# EAGLE design 85-2031red (EAGLE 6.6.0)
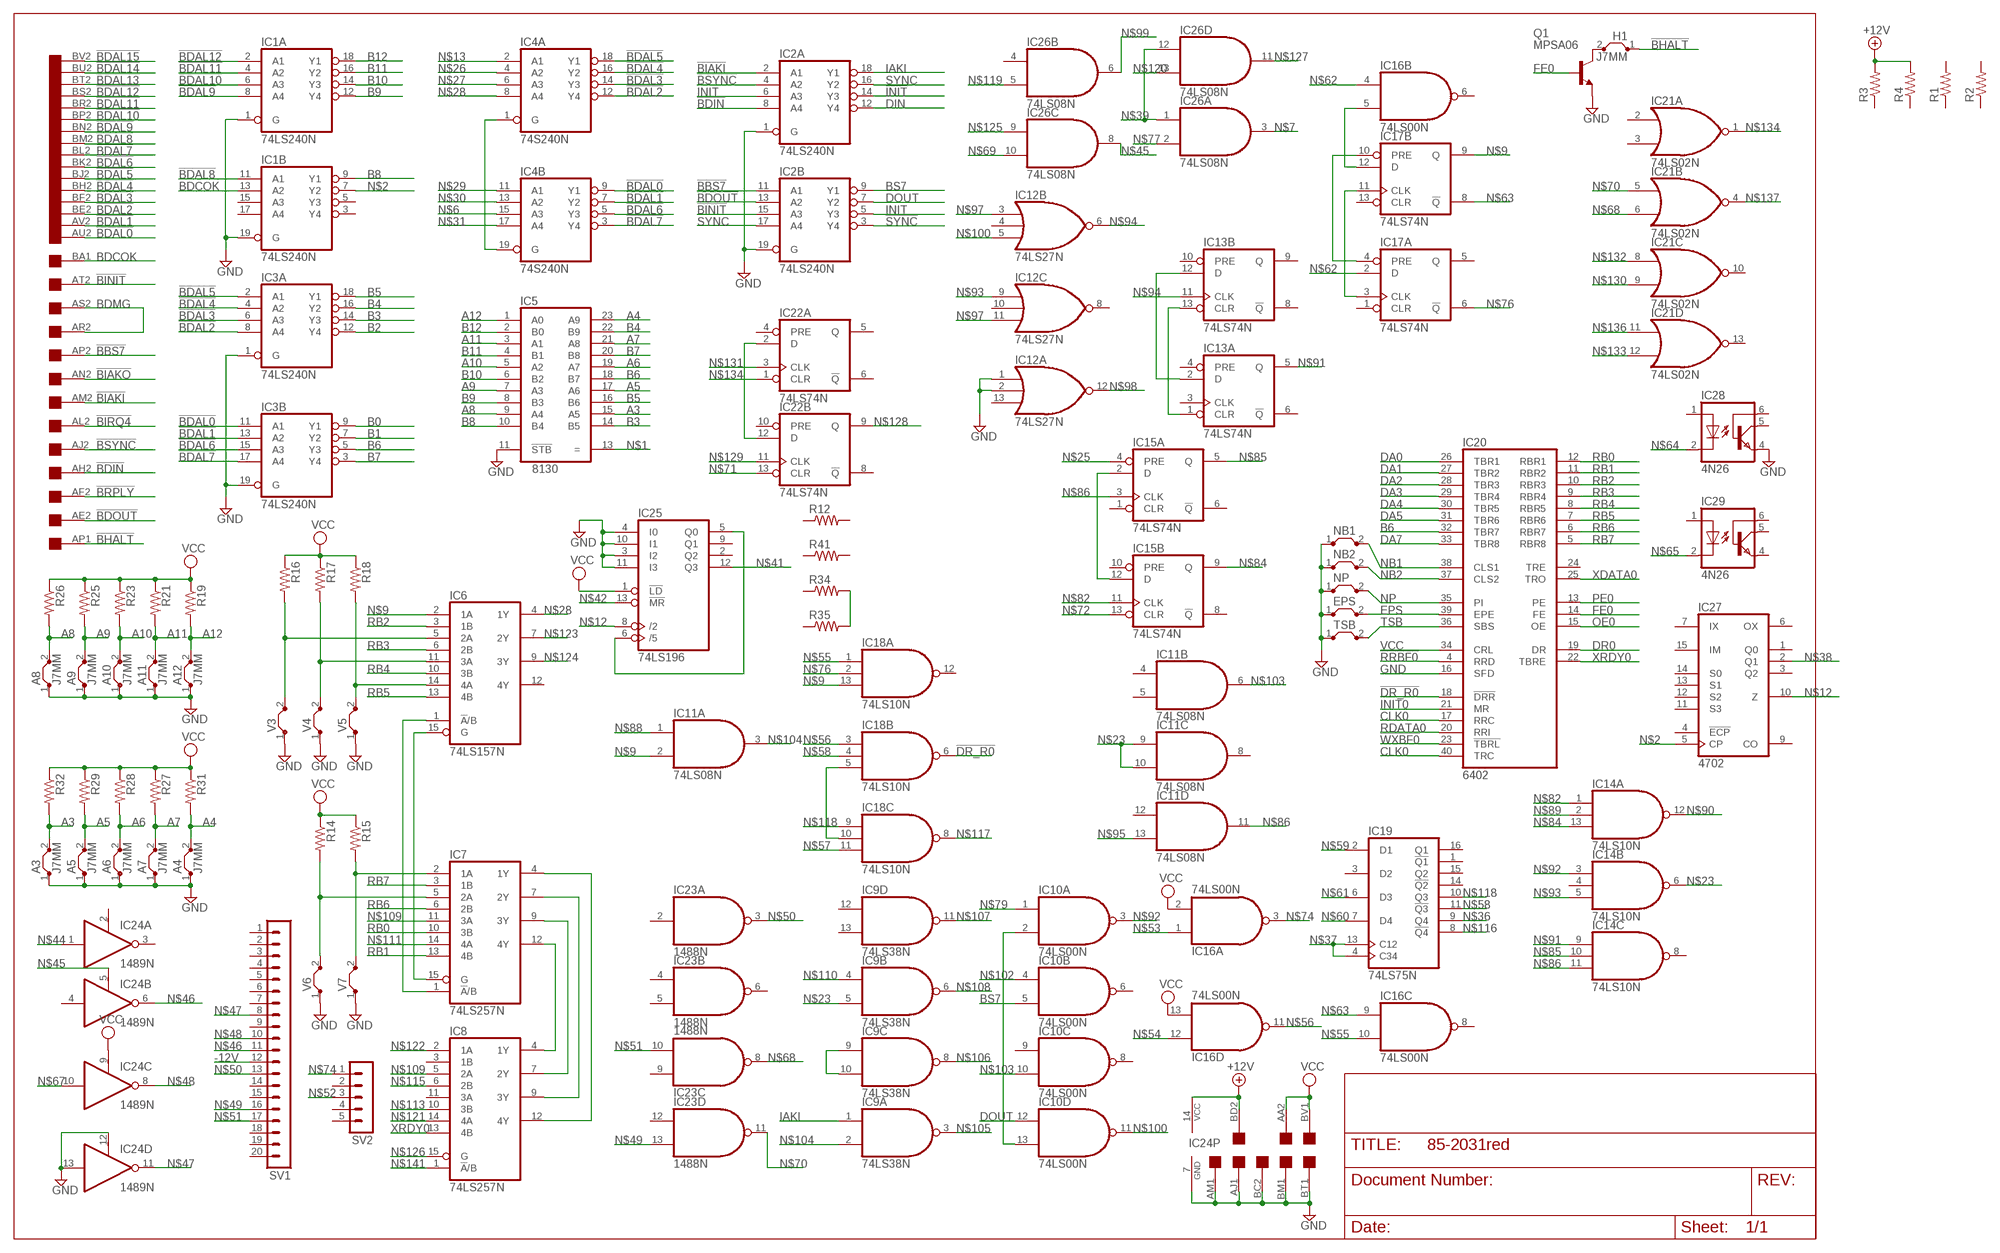
[diagram p0: schematic, sheet 1]

## Parts
A3  J7MM  [07]
A4  J7MM  [07]
A5  J7MM  [07]
A6  J7MM  [07]
A7  J7MM  [07]
A8  J7MM  [07]
A9  J7MM  [07]
A10  J7MM  [07]
A11  J7MM  [07]
A12  J7MM  [07]
EDGE$  DOUBLE  [EDGE-CON4]
EPS  J7MM  [07]
H1  J7MM  [07]
IC1  74LS240N  [DIL20]
IC2  74LS240N  [DIL20]
IC3  74LS240N  [DIL20]
IC4  74S240N  [DIL20]
IC5  8130  [DIL24]
IC6  74LS157N  [DIL16]
IC7  74LS257N  [DIL16]
IC8  74LS257N  [DIL16]
IC9  74LS38N  [DIL14]
IC10  74LS00N  [DIL14]
IC11  74LS08N  [DIL14]
IC12  74LS27N  [DIL14]
IC13  74LS74N  [DIL14]
IC14  74LS10N  [DIL14]
IC15  74LS74N  [DIL14]
IC16  74LS00N  [DIL14]
IC17  74LS74N  [DIL14]
IC18  74LS10N  [DIL14]
IC19  74LS75N  [DIL16]
IC20  6402  HD6402  [DIL40]
IC21  74LS02N  [DIL14]
IC22  74LS74N  [DIL14]
IC23  1488N  [DIL14]
IC24  1489N  [DIL14]
IC25  74LS196  [DIL14]
IC26  74LS08N  [DIL14]
IC27  4702  HD4702  [DIL16]
IC28  4N26  4N35  [DIL06]
IC29  4N26  4N35  [DIL06]
NB1  J7MM  [07]
NB2  J7MM  [07]
NP  J7MM  [07]
Q1  MPSA06  -NPN-TO92L  [TO92L]
R1  R-US_0207/10  [0207/10]
R2  R-US_0207/10  [0207/10]
R3  R-US_0207/10  [0207/10]
R4  R-US_0207/10  [0207/10]
R12  R-US_0207/10  [0207/10]
R14  R-US_0207/10  [0207/10]
R15  R-US_0207/10  [0207/10]
R16  R-US_0207/10  [0207/10]
R17  R-US_0207/10  [0207/10]
R18  R-US_0207/10  [0207/10]
R19  R-US_0207/10  [0207/10]
R21  R-US_0207/10  [0207/10]
R23  R-US_0207/10  [0207/10]
R25  R-US_0207/10  [0207/10]
R26  R-US_0207/10  [0207/10]
R27  R-US_0207/10  [0207/10]
R28  R-US_0207/10  [0207/10]
R29  R-US_0207/10  [0207/10]
R31  R-US_0207/10  [0207/10]
R32  R-US_0207/10  [0207/10]
R34  R-US_0207/10  [0207/10]
R35  R-US_0207/10  [0207/10]
R41  R-US_0207/10  [0207/10]
SV1  MA20-1  [MA20-1]
SV2  MA05-1  [MA05-1]
TSB  J7MM  [07]
V3  J7MM  [07]
V4  J7MM  [07]
V5  J7MM  [07]
V6  J7MM  [07]
V7  J7MM  [07]

## Nets
!BBS7: EDGE$.AP2 IC2.11(B:A1)
!BDAL0: EDGE$.AU2 IC3.11(B:A1) IC4.9(B:Y1)
!BDAL1: EDGE$.AV2 IC3.13(B:A2) IC4.7(B:Y2)
!BDAL2: EDGE$.BE2 IC3.8(A:A4) IC4.12(A:Y4)
!BDAL3: EDGE$.BF2 IC3.6(A:A3) IC4.14(A:Y3)
!BDAL4: EDGE$.BH2 IC3.4(A:A2) IC4.16(A:Y2)
!BDAL5: EDGE$.BJ2 IC3.2(A:A1) IC4.18(A:Y1)
!BDAL6: EDGE$.BK2 IC3.15(B:A3) IC4.5(B:Y3)
!BDAL7: EDGE$.BL2 IC3.17(B:A4) IC4.3(B:Y4)
!BDAL8: EDGE$.BM2 IC1.11(B:A1)
!BDAL9: EDGE$.BN2 IC1.8(A:A4)
!BDAL10: EDGE$.BP2 IC1.6(A:A3)
!BDAL11: EDGE$.BR2 IC1.4(A:A2)
!BDAL12: EDGE$.BS2 IC1.2(A:A1)
!BDAL13: EDGE$.BT2
!BDAL14: EDGE$.BU2
!BDAL15: EDGE$.BV2
!BDIN: EDGE$.AH2 IC2.8(A:A4)
!BDOUT: EDGE$.AE2 IC2.13(B:A2)
!BHALT: EDGE$.AP1 H1.1
!BIAKI: EDGE$.AM2 IC2.2(A:A1)
!BIAKO: EDGE$.AN2
!BINIT: EDGE$.AT2 IC2.15(B:A3)
!BIRQ4: EDGE$.AL2
!BRPLY: EDGE$.AF2
!BSYNC: EDGE$.AJ2 IC2.4(A:A2)
!DR_R0: IC18.6(B:O) IC20.18(!DRR)
!INIT: IC2.14(A:Y3)
!RRBF0: IC20.4(RRD)
!SYNC: IC2.3(B:Y4)
!WXBF0: IC20.23(!TBRL)
+12V [Supply]: EDGE$.BD2 IC24.14(P:VCC) R3.2 R4.2
-12V: SV1.12
A3: A3.2 IC5.15(A5) R32.2
A4: A4.2 IC5.23(A9) R31.2
A5: A5.2 IC5.17(A6) R29.2
A6: A6.2 IC5.19(A7) R28.2
A7: A7.2 IC5.21(A8) R27.2
A8: A8.2 IC5.9(A4) R26.2
A9: A9.2 IC5.7(A3) R25.2
A10: A10.2 IC5.5(A2) R23.2
A11: A11.2 IC5.3(A1) R21.2
A12: A12.2 IC5.1(A0) R19.2
B0: IC3.9(B:Y1) IC22.2(A:D) IC22.12(B:D)
B1: IC3.7(B:Y2)
B2: IC3.12(A:Y4)
B3: IC3.14(A:Y3) IC5.14(B5)
B4: IC3.16(A:Y2) IC5.22(B9)
B5: IC3.18(A:Y1) IC5.16(B6)
B6: IC3.5(B:Y3) IC5.18(B7) IC20.32(TBR7)
B7: IC3.3(B:Y4) IC5.20(B8)
B8: IC1.9(B:Y1) IC5.10(B4)
B9: IC1.12(A:Y4) IC5.8(B3)
B10: IC1.14(A:Y3) IC5.6(B2)
B11: IC1.16(A:Y2) IC5.4(B1)
B12: IC1.18(A:Y1) IC5.2(B0)
BDCOK: EDGE$.BA1 IC1.13(B:A2)
BDMG: EDGE$.AR2 EDGE$.AS2
BS7: IC2.9(B:Y1) IC10.5(B:I1)
CLK0: IC20.17(RRC) IC20.40(TRC)
DA0: IC20.26(TBR1)
DA1: IC20.27(TBR2)
DA2: IC20.28(TBR3)
DA3: IC20.29(TBR4)
DA4: IC20.30(TBR5)
DA5: IC20.31(TBR6)
DA7: IC20.33(TBR8)
DIN: IC2.12(A:Y4)
DOUT: IC2.7(B:Y2) IC10.12(D:I0)
DR0: IC20.19(DR)
EPS: EPS.2 IC20.39(EPE)
FE0: IC20.14(FE) Q1.2(B)
GND [Supply]: A3.1 A4.1 A5.1 A6.1 A7.1 A8.1 A9.1 A10.1 A11.1 A12.1 EDGE$.AJ1 EDGE$.AM1 EDGE$.BC2 EDGE$.BM1 EDGE$.BT1 EPS.1 IC1.1(A:G) IC1.19(B:G) IC2.1(A:G) IC2.19(B:G) IC3.1(A:G) IC3.19(B:G) IC5.11(!STB) IC12.1(A:I0) IC12.2(A:I1) IC20.16(SFD) IC24.7(P:GND) IC24.12(D:RC) IC24.13(D:I) IC25.3(I2) IC25.4(I0) IC25.10(I1) IC25.11(I3) IC28.4(EMI) NB1.1 NB2.1 NP.1 Q1.1(E) TSB.1 V3.1 V4.1 V5.1 V6.1 V7.1
IAKI: IC2.18(A:Y1) IC9.1(A:I0)
INIT: IC2.5(B:Y3) IC2.6(A:A3)
INIT0: IC20.21(MR)
N$1: IC5.13(=)
N$2: IC1.7(B:Y2) IC27.5(CP)
N$3: H1.2 Q1.3(C)
N$4: IC6.15(G) IC7.15(G)
N$5: IC6.1(!A!/B) IC7.1(!A!/B)
N$6: IC4.15(B:A3)
N$7: IC4.1(A:G) IC4.19(B:G) IC26.3(A:O)
N$8: IC6.14(4A) R18.2 V5.2
N$9: IC6.2(1A) IC11.2(A:I1) IC17.9(B:Q) IC18.13(A:I2)
N$10: IC7.12(4Y) IC8.4(1Y)
N$11: IC7.9(3Y) IC8.7(2Y)
N$12: IC25.8(/2) IC27.10(Z)
N$13: IC4.2(A:A1)
N$14: IC7.7(2Y) IC8.9(3Y)
N$15: IC7.4(1Y) IC8.12(4Y)
N$17: IC7.2(1A) R15.2 V7.2
N$18: IC7.5(2A) R14.2 V6.2
N$19: IC9.9(C:I0) IC9.10(C:I1)
N$20: R34.2 R35.2
N$21: IC6.11(3A) R17.2 V4.2
N$22: IC10.2(A:I1) IC10.13(D:I1)
N$23: IC9.5(B:I1) IC11.9(C:I0) IC11.10(C:I1) IC14.6(B:O)
N$24: IC6.5(2A) R16.2 V3.2
N$25: IC13.1(A:CLR) IC13.13(B:CLR) IC15.4(A:PRE)
N$26: IC4.4(A:A2)
N$27: IC4.6(A:A3)
N$28: IC4.8(A:A4) IC6.4(1Y)
N$29: IC4.11(B:A1)
N$30: IC4.13(B:A2)
N$31: IC4.17(B:A4)
N$32: IC13.2(A:D) IC13.12(B:D)
N$33: IC16.5(B:I1) IC17.12(B:D)
N$34: IC17.3(A:CLK) IC17.11(B:CLK)
N$35: IC17.4(A:PRE) IC17.10(B:PRE)
N$36: IC18.5(B:I2) IC18.10(C:I1) IC19.9(Q4)
N$37: IC19.4(C34) IC19.13(C12)
N$38: IC27.2(Q1)
N$39: IC26.1(A:I0) IC26.12(D:I0)
N$40: IC25.5(Q0) IC25.6(/5)
N$41: IC25.12(Q3)
N$42: IC25.13(!MR)
N$44: IC24.1(A:I)
N$45: IC24.5(B:RC) IC26.8(C:O)
N$46: IC24.6(B:O) SV1.11
N$47: IC24.11(D:O) SV1.8
N$48: IC24.8(C:O) SV1.10
N$49: IC23.13(D:I1) SV1.16
N$50: IC23.3(A:O) SV1.13
N$51: IC23.10(C:I1) SV1.17
N$52: SV2.3
N$53: IC16.1(A:I0)
N$54: IC16.12(D:I0)
N$55: IC16.10(C:I1) IC18.1(A:I0)
N$56: IC16.11(D:O) IC18.3(B:I0)
N$57: IC18.11(C:I2)
N$58: IC18.4(B:I1) IC19.11(!Q3)
N$59: IC19.2(D1)
N$60: IC19.7(D4)
N$61: IC19.6(D3)
N$62: IC16.4(B:I0) IC17.2(A:D)
N$63: IC16.9(C:I0) IC17.8(B:!Q)
N$64: IC28.2(C)
N$65: IC29.2(C)
N$67: IC24.10(C:I)
N$68: IC21.6(B:I1) IC23.8(C:O)
N$69: IC26.10(C:I1)
N$70: IC21.5(B:I0) IC23.11(D:O)
N$71: IC22.13(B:CLR)
N$72: IC15.13(B:CLR)
N$74: IC16.3(A:O) SV2.1
N$76: IC17.6(A:!Q) IC18.2(A:I1)
N$77: IC26.2(A:I1)
N$79: IC10.1(A:I0)
N$82: IC14.1(A:I0) IC15.11(B:CLK)
N$83: IC15.2(A:D) IC15.12(B:D)
N$84: IC14.13(A:I2) IC15.9(B:Q)
N$85: IC14.10(C:I1) IC15.5(A:Q)
N$86: IC11.11(D:O) IC14.11(C:I2) IC15.3(A:CLK)
N$88: IC11.1(A:I0)
N$89: IC14.2(A:I1)
N$90: IC14.12(A:O)
N$91: IC13.5(A:Q) IC14.9(C:I0)
N$92: IC10.3(A:O) IC14.3(B:I0)
N$93: IC12.9(C:I0) IC14.5(B:I2)
N$94: IC12.6(B:O) IC13.11(B:CLK)
N$95: IC11.13(D:I1)
N$97: IC12.3(B:I0) IC12.11(C:I2)
N$98: IC12.12(A:O)
N$99: IC26.6(B:O)
N$100: IC10.11(D:O) IC12.5(B:I2)
N$102: IC10.4(B:I0)
N$103: IC10.10(C:I1) IC11.6(B:O)
N$104: IC9.2(A:I1) IC11.3(A:O)
N$105: IC9.3(A:O)
N$106: IC9.8(C:O)
N$107: IC9.11(D:O)
N$108: IC9.6(B:O)
N$109: IC7.11(3A) IC8.5(2A)
N$110: IC9.4(B:I0)
N$111: IC7.14(4A)
N$113: IC8.10(3B)
N$115: IC8.6(2B)
N$116: IC19.8(!Q4)
N$117: IC18.8(C:O)
N$118: IC18.9(C:I0) IC19.10(Q3)
N$119: IC26.5(B:I1)
N$120: IC26.13(D:I1)
N$121: IC8.14(4A)
N$122: IC8.2(1A)
N$123: IC6.7(2Y)
N$124: IC6.9(3Y)
N$125: IC26.9(C:I0)
N$126: IC8.15(G)
N$127: IC26.11(D:O)
N$128: IC22.9(B:Q)
N$129: IC22.11(B:CLK)
N$130: IC21.9(C:I1)
N$131: IC22.3(A:CLK)
N$132: IC21.8(C:I0)
N$133: IC21.12(D:I1)
N$134: IC21.1(A:O) IC22.1(A:CLR)
N$136: IC21.11(D:I0)
N$137: IC21.4(B:O)
N$141: IC8.1(!A!/B)
NB1: IC20.38(CLS1) NB1.2
NB2: IC20.37(CLS2) NB2.2
NP: IC20.35(PI) NP.2
OE0: IC20.15(OE)
PE0: IC20.13(PE)
RB0: IC7.10(3B) IC20.12(RBR1)
RB1: IC7.13(4B) IC20.11(RBR2)
RB2: IC6.3(1B) IC20.10(RBR3)
RB3: IC6.6(2B) IC20.9(RBR4)
RB4: IC6.10(3B) IC20.8(RBR5)
RB5: IC6.13(4B) IC20.7(RBR6)
RB6: IC7.6(2B) IC20.6(RBR7)
RB7: IC7.3(1B) IC20.5(RBR8)
RDATA0: IC20.20(RRI)
SYNC: IC2.16(A:Y2) IC2.17(B:A4)
TSB: IC20.36(SBS) TSB.2
VCC: EDGE$.AA2 EDGE$.BV1 IC16.2(A:I1) IC16.13(D:I1) IC20.34(CRL) IC24.9(C:RC) IC25.1(!LD) R14.1 R15.1 R16.1 R17.1 R18.1 R19.1 R21.1 R23.1 R25.1 R26.1 R27.1 R28.1 R29.1 R31.1 R32.1
XDATA0: IC20.25(TRO)
XRDY0: IC8.13(4B) IC20.22(TBRE)
Unconnected: EDGE$.AA1 EDGE$.AB1 EDGE$.AB2 EDGE$.AC1 EDGE$.AC2 EDGE$.AD1 EDGE$.AD2 EDGE$.AE1 EDGE$.AF1 EDGE$.AH1 EDGE$.AK1 EDGE$.AK2 EDGE$.AL1 EDGE$.AN1 EDGE$.AR1 EDGE$.AS1 EDGE$.AT1 EDGE$.AU1 EDGE$.AV1 EDGE$.BA2 EDGE$.BB1 EDGE$.BB2 EDGE$.BC1 EDGE$.BD1 EDGE$.BE1 EDGE$.BF1 EDGE$.BH1 EDGE$.BJ1 EDGE$.BK1 EDGE$.BL1 EDGE$.BN1 EDGE$.BP1 EDGE$.BR1 EDGE$.BS1 EDGE$.BU1 IC1.3(B:Y4) IC1.5(B:Y3) IC1.15(B:A3) IC1.17(B:A4) IC6.12(4Y) IC8.3(1B) IC8.11(3A) IC9.12(D:I0) IC9.13(D:I1) IC10.6(B:O) IC10.8(C:O) IC10.9(C:I0) IC11.4(B:I0) IC11.5(B:I1) IC11.8(C:O) IC11.12(D:I0) IC12.4(B:I1) IC12.8(C:O) IC12.10(C:I1) IC12.13(A:I2) IC13.3(A:CLK) IC13.4(A:PRE) IC13.6(A:!Q) IC13.8(B:!Q) IC13.9(B:Q) IC13.10(B:PRE) IC14.4(B:I1) IC14.8(C:O) IC15.1(A:CLR) IC15.6(A:!Q) IC15.8(B:!Q) IC15.10(B:PRE) IC16.6(B:O) IC16.8(C:O) IC17.1(A:CLR) IC17.5(A:Q) IC17.13(B:CLR) IC18.12(A:O) IC19.1(!Q1) IC19.3(D2) IC19.14(!Q2) IC19.15(Q2) IC19.16(Q1) IC20.24(TRE) IC21.2(A:I0) IC21.3(A:I1) IC21.10(C:O) IC21.13(D:O) IC22.4(A:PRE) IC22.5(A:Q) IC22.6(A:!Q) IC22.8(B:!Q) IC22.10(B:PRE) IC23.2(A:I) IC23.4(B:I0) IC23.5(B:I1) IC23.6(B:O) IC23.9(C:I0) IC23.12(D:I0) IC24.2(A:RC) IC24.3(A:O) IC24.4(B:I) IC25.2(Q2) IC25.9(Q1) IC26.4(B:I0) IC27.1(Q0) IC27.3(Q2) IC27.4(!ECP) IC27.6(OX) IC27.7(IX) IC27.9(CO) IC27.11(S3) IC27.12(S2) IC27.13(S1) IC27.14(S0) IC27.15(IM) IC28.1(A) IC28.5(COL) IC28.6(BAS) IC29.1(A) IC29.4(EMI) IC29.5(COL) IC29.6(BAS) R1.1 R1.2 R2.1 R2.2 R3.1 R4.1 R12.1 R12.2 R34.1 R35.1 R41.1 R41.2 SV1.1 SV1.2 SV1.3 SV1.4 SV1.5 SV1.6 SV1.7 SV1.9 SV1.14 SV1.15 SV1.18 SV1.19 SV1.20 SV2.2 SV2.4 SV2.5

## Power pins joined to a net without a drawn wire
+12V: IC23.14(P:+12V)
-12V: IC23.1(P:-12V)
GND: IC1.10(P:GND) IC2.10(P:GND) IC3.10(P:GND) IC4.10(P:GND) IC5.12(GND) IC6.8(GND) IC7.8(GND) IC8.8(GND) IC9.7(P:GND) IC10.7(P:GND) IC11.7(P:GND) IC12.7(P:GND) IC13.7(P:GND) IC14.7(P:GND) IC15.7(P:GND) IC16.7(P:GND) IC17.7(P:GND) IC18.7(P:GND) IC19.12(GND) IC20.3(GND) IC21.7(P:GND) IC22.7(P:GND) IC23.7(P:GND) IC25.7(GND) IC26.7(P:GND) IC27.8(GND)
VCC: IC1.20(P:VCC) IC2.20(P:VCC) IC3.20(P:VCC) IC4.20(P:VCC) IC5.24(VCC) IC6.16(VCC) IC7.16(VCC) IC8.16(VCC) IC9.14(P:VCC) IC10.14(P:VCC) IC11.14(P:VCC) IC12.14(P:VCC) IC13.14(P:VCC) IC14.14(P:VCC) IC15.14(P:VCC) IC16.14(P:VCC) IC17.14(P:VCC) IC18.14(P:VCC) IC19.5(VCC) IC20.1(VCC) IC21.14(P:VCC) IC22.14(P:VCC) IC25.14(VCC) IC26.14(P:VCC) IC27.16(VCC)

## Library data of the parts
A3-A12 EPS H1 NB1 NB2 NP TSB V3-V7 = jumper:J: Bridge
EDGE$ = dec-con:DOUBLE: Double-Height DEC board
IC1-IC4 = 74xx-us:74*240: Octal BUFFER and LINE DRIVER, 3-state
IC5 = dec-con:8130: 10 bit comparator
IC6 = 74xx-us:74*157: Quadruple 2-line to 1-line data SELECTOR/MULTIPLEXER
IC7 IC8 = 74xx-us:74*257: Quadruple 2-to 1 line data SELECTOR/MULTIPLEXER
IC9 = dec-con:74*38: Quad 2-input NAND gate, open collector output
IC10 IC16 = 74xx-us:74*00: Quad 2-input NAND gate
IC11 IC26 = 74xx-us:74*08: Quad 2-input AND gate
IC12 = 74xx-us:74*27: Triple 3-input NOR gate
IC13 IC15 IC17 IC22 = 74xx-us:74*74: Dual D type positive edge triggered FLIP FLOP, preset and clear
IC14 IC18 = 74xx-us:74*10: Triple 3-input NAND gate
IC19 = 74xx-us:74*75: 4-bit bistable LATCH
IC20 = micro-harris:HD6402: MICROCONTROLLER/MEMORY DEVICE; OC_FARNELL: unknown; OC_NEWARK: unknown
IC21 = 74xx-us:74*02: Quad 2-input NOR gate
IC23 = dec-con:14*88: Quad 2-input NAND gate
IC24 = dec-con:14*89: Quad line receivers BUFFER,
IC25 = dec-con:74LS196: Loadable decade counter
IC27 = micro-harris:HD4702: MICROCONTROLLER/MEMORY DEVICE; OC_FARNELL: unknown; OC_NEWARK: unknown
IC28 IC29 = optocoupler:4N35: MOTOROLA OPTO COUPLER; MF: FAIRCHILD SEMICONDUCTOR; MPN: 4N35; OC_FARNELL: 1328375; OC_NEWARK: 72K9946
Q1 = transistor:*-NPN-: NPN Transistror BF959 corrected 2008.03.06
R1-R4 R12 R14-R19 R21 R23 R25-R29 R31 R32 R34 R35 R41 = rcl:R-US_: RESISTOR, American symbol
SV1 = con-lstb:MA20-1: PIN HEADER; OC_FARNELL: unknown; OC_NEWARK: unknown
SV2 = con-lstb:MA05-1: PIN HEADER; OC_FARNELL: unknown; OC_NEWARK: unknown

## Net classes
1 Supply: width 0.635 mm

## Board
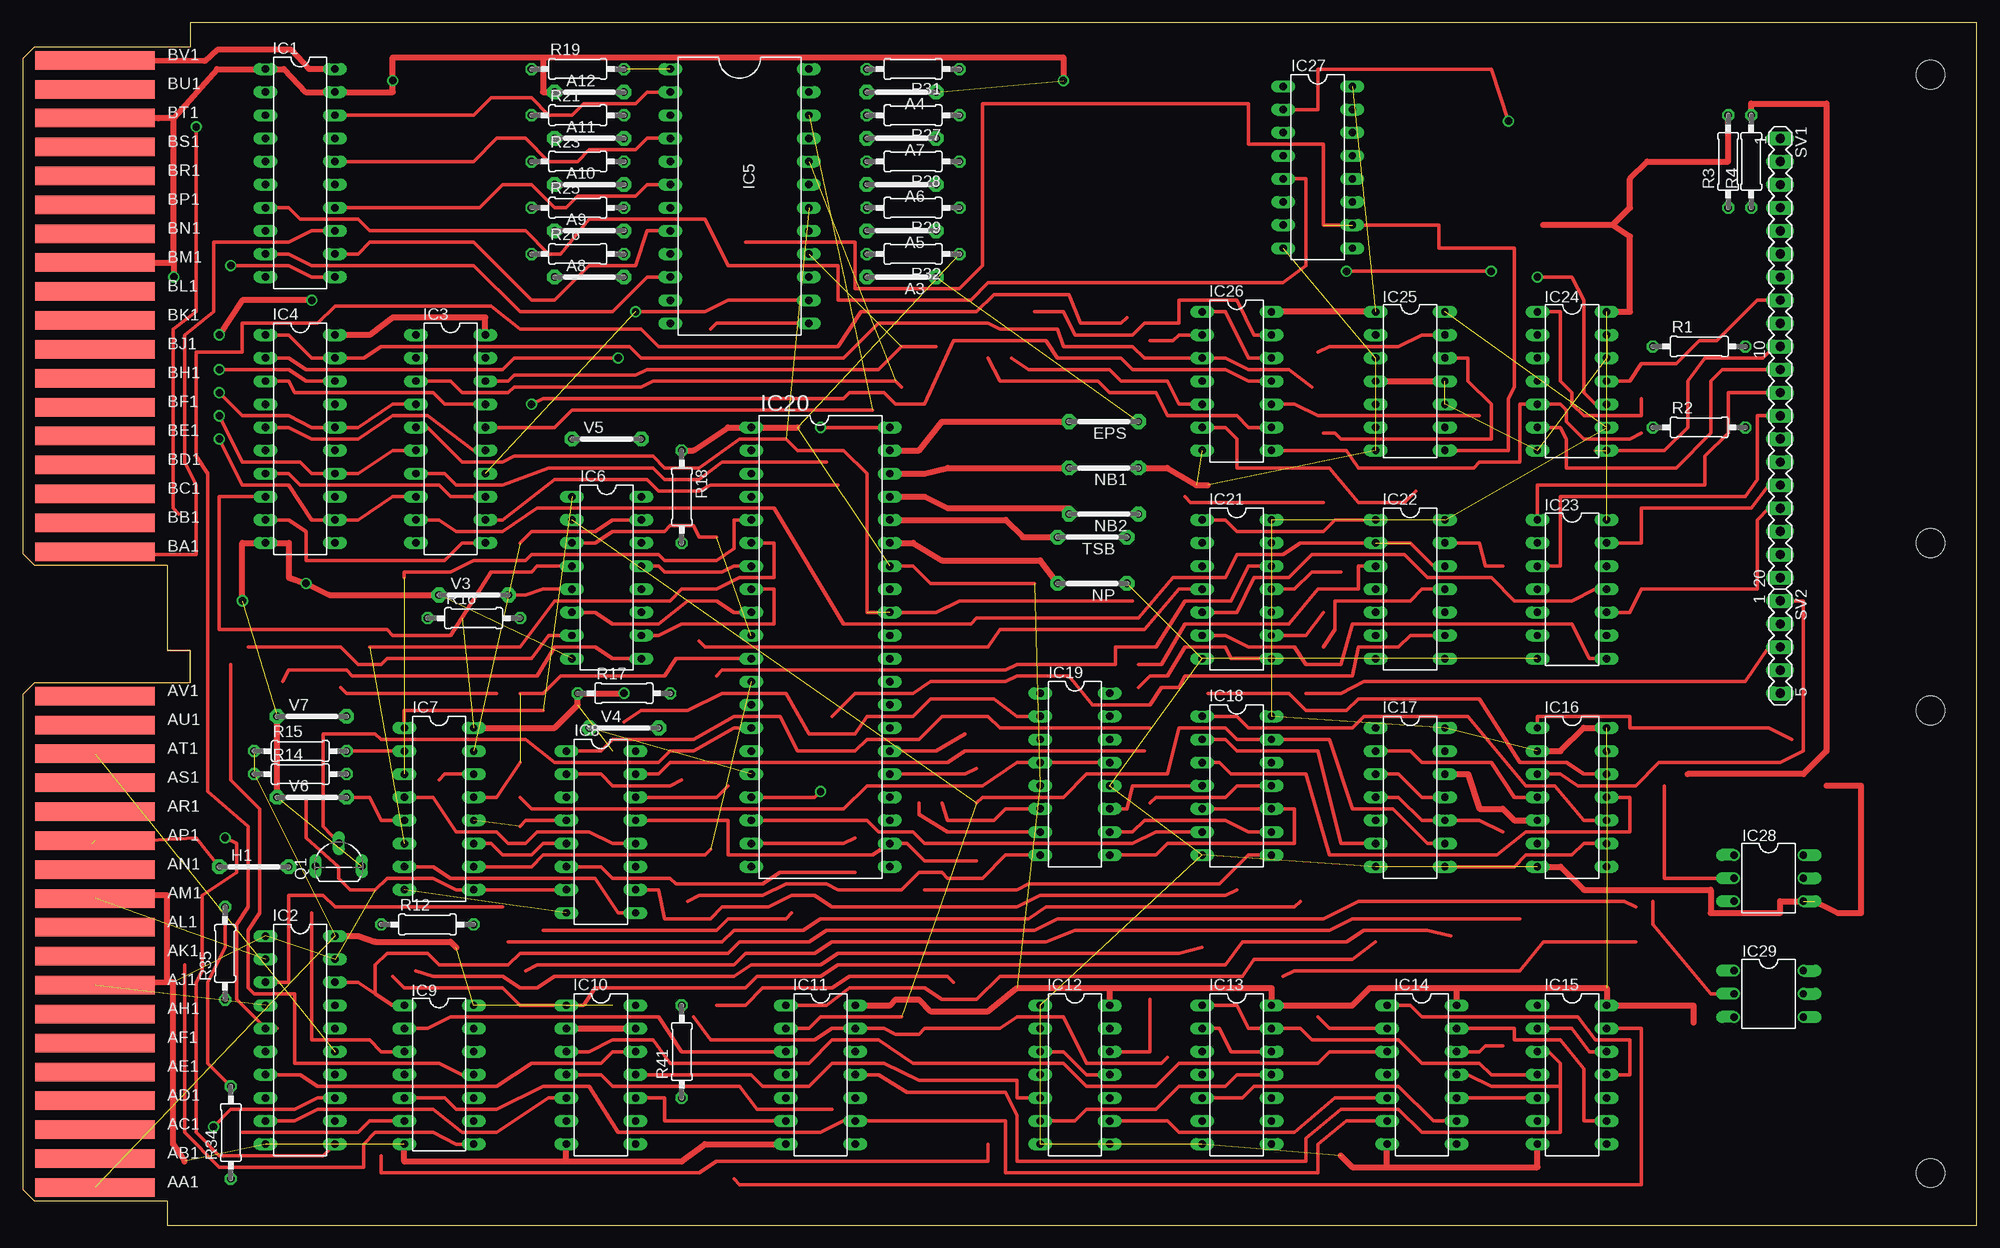
[diagram p1: board, top side]
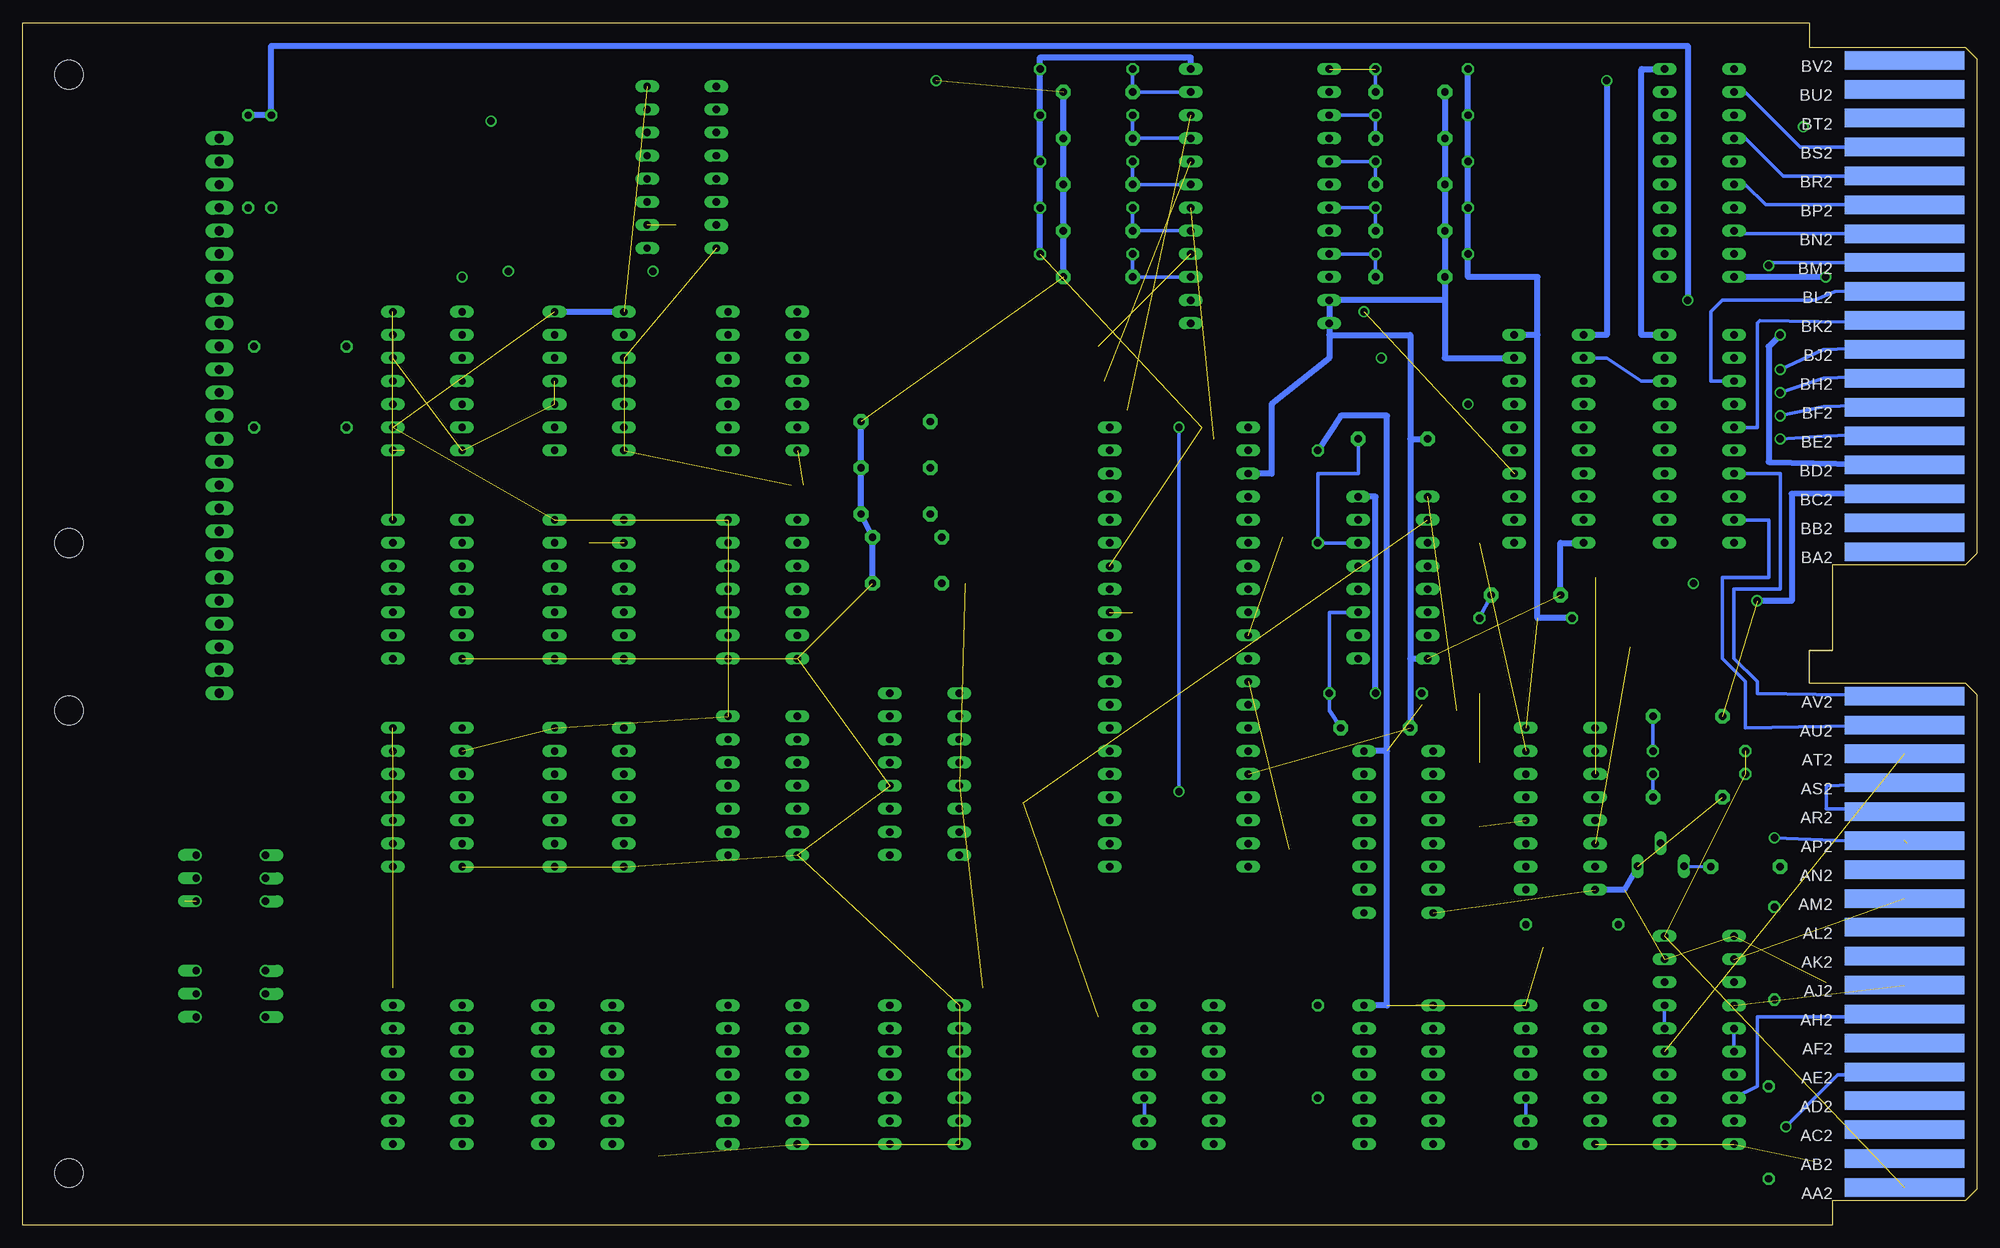
[diagram p2: board, bottom side, seen from below]

Size 214.63 x 132.08 mm. Coordinates in mm from the lower left corner, seen from the top.
Copper layers (1+16): Top 0.035mm / dielectric 1.5mm / Bottom 0.035mm
Design rules "16mils": minimum track width 16mil, minimum drill 32mil, track to track 15mil, track to pad 10mil, pad to pad 10mil, via to via 10mil, smd to smd 10mil, copper to edge 13mil, drill to drill 10mil, minimum pad ring 10mil, minimum via ring 8mil, stop-mask expansion 0mil, vias tented up to drill 0mil, thermal gap 10mil

### Footprints (pad centres in the part's own frame; a part is rotated, then mirrored left to right if it is on the bottom)
07 = drill 0.813 pad 1.6 octagon: 1 -3.81,0; 2 3.81,0
DOUBLE-LONG = hole 3.175: 209.55,56.515; 209.55,5.715; 209.55,74.93; 209.55,126.365
EDGE-CON4 = smd 13.106 x 2.032: AA1 7.938,4.128; AB1 7.938,7.303; AC1 7.938,10.477; AD1 7.938,13.652; AE1 7.938,16.828; AF1 7.938,20.003; AH1 7.938,23.177; AJ1 7.938,26.352; AK1 7.938,29.527; AL1 7.938,32.703; AM1 7.938,35.877; AN1 7.938,39.053; AP1 7.938,42.227; AR1 7.938,45.403; AS1 7.938,48.578; AT1 7.938,51.752; AU1 7.938,54.928; AV1 7.938,58.102; BA1 7.938,73.978; BB1 7.938,77.153; BC1 7.938,80.328; BD1 7.938,83.502; BE1 7.938,86.677; BF1 7.938,89.853; BH1 7.938,93.028; BJ1 7.938,96.203; BK1 7.938,99.377; BL1 7.938,102.552; BM1 7.938,105.728; BN1 7.938,108.903; BP1 7.938,112.078; BR1 7.938,115.252; BS1 7.938,118.427; BT1 7.938,121.603; BU1 7.938,124.778; BV1 7.938,127.953 | smd 13.106 x 2.032 bottom: AA2 7.938,4.128; AB2 7.938,7.303; AC2 7.938,10.477; AD2 7.938,13.652; AE2 7.938,16.828; AF2 7.938,20.003; AH2 7.938,23.177; AJ2 7.938,26.352; AK2 7.938,29.527; AL2 7.938,32.703; AM2 7.938,35.877; AN2 7.938,39.053; AP2 7.938,42.227; AR2 7.938,45.403; AS2 7.938,48.578; AT2 7.938,51.752; AU2 7.938,54.928; AV2 7.938,58.102; BA2 7.938,73.978; BB2 7.938,77.153; BC2 7.938,80.328; BD2 7.938,83.502; BE2 7.938,86.677; BF2 7.938,89.853; BH2 7.938,93.028; BJ2 7.938,96.203; BK2 7.938,99.377; BL2 7.938,102.552; BM2 7.938,105.728; BN2 7.938,108.903; BP2 7.938,112.078; BR2 7.938,115.252; BS2 7.938,118.427; BT2 7.938,121.603; BU2 7.938,124.778; BV2 7.938,127.953
DIL20 = drill 0.813 long: 1 -11.43,-3.81; 2 -8.89,-3.81; 3 -6.35,-3.81; 4 -3.81,-3.81; 5 -1.27,-3.81; 6 1.27,-3.81; 7 3.81,-3.81; 8 6.35,-3.81; 9 8.89,-3.81; 10 11.43,-3.81; 11 11.43,3.81; 12 8.89,3.81; 13 6.35,3.81; 14 3.81,3.81; 15 1.27,3.81; 16 -1.27,3.81; 17 -3.81,3.81; 18 -6.35,3.81; 19 -8.89,3.81; 20 -11.43,3.81
DIL24 = drill 0.813 long: 1 -12.7,-7.62; 2 -10.16,-7.62; 3 -7.62,-7.62; 4 -5.08,-7.62; 5 -2.54,-7.62; 6 0,-7.62; 7 2.54,-7.62; 8 5.08,-7.62; 9 7.62,-7.62; 10 10.16,-7.62; 11 12.7,-7.62; 12 15.24,-7.62; 13 15.24,7.62; 14 12.7,7.62; 15 10.16,7.62; 16 7.62,7.62; 17 5.08,7.62; 18 2.54,7.62; 19 0,7.62; 20 -2.54,7.62; 21 -5.08,7.62; 22 -7.62,7.62; 23 -10.16,7.62; 24 -12.7,7.62
DIL16 = drill 0.813 long: 1 -8.89,-3.81; 2 -6.35,-3.81; 3 -3.81,-3.81; 4 -1.27,-3.81; 5 1.27,-3.81; 6 3.81,-3.81; 7 6.35,-3.81; 8 8.89,-3.81; 9 8.89,3.81; 10 6.35,3.81; 11 3.81,3.81; 12 1.27,3.81; 13 -1.27,3.81; 14 -3.81,3.81; 15 -6.35,3.81; 16 -8.89,3.81
DIL14 = drill 0.813 long: 1 -7.62,-3.81; 2 -5.08,-3.81; 3 -2.54,-3.81; 4 0,-3.81; 5 2.54,-3.81; 6 5.08,-3.81; 7 7.62,-3.81; 8 7.62,3.81; 9 5.08,3.81; 10 2.54,3.81; 11 0,3.81; 12 -2.54,3.81; 13 -5.08,3.81; 14 -7.62,3.81
DIL40 = drill 0.813 long: 1 -24.13,-7.62; 2 -21.59,-7.62; 3 -19.05,-7.62; 4 -16.51,-7.62; 5 -13.97,-7.62; 6 -11.43,-7.62; 7 -8.89,-7.62; 8 -6.35,-7.62; 9 -3.81,-7.62; 10 -1.27,-7.62; 11 1.27,-7.62; 12 3.81,-7.62; 13 6.35,-7.62; 14 8.89,-7.62; 15 11.43,-7.62; 16 13.97,-7.62; 17 16.51,-7.62; 18 19.05,-7.62; 19 21.59,-7.62; 20 24.13,-7.62; 21 24.13,7.62; 22 21.59,7.62; 23 19.05,7.62; 24 16.51,7.62; 25 13.97,7.62; 26 11.43,7.62; 27 8.89,7.62; 28 6.35,7.62; 29 3.81,7.62; 30 1.27,7.62; 31 -1.27,7.62; 32 -3.81,7.62; 33 -6.35,7.62; 34 -8.89,7.62; 35 -11.43,7.62; 36 -13.97,7.62; 37 -16.51,7.62; 38 -19.05,7.62; 39 -21.59,7.62; 40 -24.13,7.62
DIL06 = drill 0.813 offset: 1 -2.54,-3.81; 2 0,-3.81; 3 2.54,-3.81; 4 2.54,3.81; 5 0,3.81; 6 -2.54,3.81
TO92L = drill 0.813 long: 1 0,-2.54; 2 2.54,0; 3 0,2.54
0207/10 = drill 0.813 octagon: 1 -5.08,0; 2 5.08,0
MA20-1 = drill 1.016 long: 1 -24.13,0; 2 -21.59,0; 3 -19.05,0; 4 -16.51,0; 5 -13.97,0; 6 -11.43,0; 7 -8.89,0; 8 -6.35,0; 9 -3.81,0; 10 -1.27,0; 11 1.27,0; 12 3.81,0; 13 6.35,0; 14 8.89,0; 15 11.43,0; 16 13.97,0; 17 16.51,0; 18 19.05,0; 19 21.59,0; 20 24.13,0
MA05-1 = drill 1.016 long: 1 -5.08,0; 2 -2.54,0; 3 0,0; 4 2.54,0; 5 5.08,0

### Placement (x,y rotation side)
A3  96.52,104.14 180 top
A4  96.52,124.46 180 top
A5  96.52,109.22 180 top
A6  96.52,114.3 180 top
A7  96.52,119.38 180 top
A8  62.23,104.14 0 top
A9  62.23,109.22 0 top
A10  62.23,114.3 0 top
A11  62.23,119.38 0 top
A12  62.23,124.46 0 top
E$2  [DOUBLE-LONG]  0,0 0 top
EDGE$  0,0 0 top
EPS  118.75,88.27 180 top
H1  25.4,39.37 0 top
IC1  30.48,115.57 270 top
IC2  30.48,20.32 270 top
IC3  46.99,86.36 270 top
IC4  30.48,86.36 270 top
IC5  78.74,114.3 270 top
IC6  64.14,71.12 270 top
IC7  45.72,45.72 270 top
IC8  63.5,43.18 270 top
IC9  45.72,16.51 270 top
IC10  63.5,16.51 270 top
IC11  87.63,16.51 270 top
IC12  115.57,16.51 270 top
IC13  133.35,16.51 270 top
IC14  153.67,16.51 270 top
IC15  170.18,16.51 270 top
IC16  170.18,46.99 270 top
IC17  152.4,46.99 270 top
IC18  133.35,48.26 270 top
IC19  115.57,49.53 270 top
IC20  87.63,63.5 270 top
IC21  133.35,69.85 270 top
IC22  152.4,69.85 270 top
IC23  170.18,69.85 270 top
IC24  170.18,92.71 270 top
IC25  152.4,92.71 270 top
IC26  133.35,92.71 270 top
IC27  142.24,116.2 270 top
IC28  191.77,38.1 270 top
IC29  191.77,25.4 270 top
NB1  118.75,83.19 180 top
NB2  118.75,78.11 180 top
NP  117.48,70.48 180 top
Q1  34.71,39.41 90 top
R1  184.15,96.52 0 top
R2  184.15,87.63 0 top
R3  187.33,116.84 90 top
R4  189.87,116.84 90 top
R12  44.45,33.02 0 top
R14  30.48,49.53 0 top
R15  30.48,52.07 0 top
R16  49.53,66.67 0 top
R17  66.04,58.42 0 top
R18  72.39,80.01 270 top
R19  60.96,127 0 top
R21  60.96,121.92 0 top
R23  60.96,116.84 0 top
R25  60.96,111.76 0 top
R26  60.96,106.68 0 top
R27  97.79,121.92 180 top
R28  97.79,116.84 180 top
R29  97.79,111.76 180 top
R31  97.79,127 180 top
R32  97.79,106.68 180 top
R34  22.86,10.16 90 top
R35  22.23,29.84 90 top
R41  72.39,19.05 90 top
SV1  193.04,95.25 270 top
SV2  193.04,63.5 270 top
TSB  117.48,75.56 180 top
V3  49.53,69.22 0 top
V4  66.04,54.61 0 top
V5  64.14,86.36 0 top
V6  31.75,46.99 0 top
V7  31.75,55.88 0 top

### Tracks (layer width: path | path; a pad name or v marks a point on that pad's centre or on a via)
!BBS7  (via drill 0.81)
  Top 0.406: IC2.11 33.02,7.62 21.59,7.62 19.05,10.16 19.05,26.67 19.69,27.94 19.69,36.2 23.5,38.73 23.5,41.91 v22.23,42.55
  Bottom 0.406: EDGE$.AP2 7.62,41.91 v22.23,42.55
!BDAL0
  Top 0.406: IC3.11 48.26,74.93 46.36,73.03 31.12,73.03 31.12,76.2 29.21,77.47 IC4.9
  Bottom 0.406: EDGE$.AU2 25.4,54.61 25.4,59.69 27.94,62.23 27.94,71.12 22.86,71.12 22.86,77.47 IC4.9
!BDAL1
  Top 0.406: IC3.13 46.99,80.01 45.72,81.28 30.48,81.28 29.21,82.55 IC4.7
  Bottom 0.406: EDGE$.AV2 24.13,58.42 24.13,59.69 26.67,62.23 26.67,69.85 21.59,69.85 21.59,82.55 IC4.7
!BDAL2  (via drill 0.81)
  Top 0.406: v21.59,86.36 24.13,81.28 29.21,81.28 31.75,77.47 IC4.12 36.83,77.47 40.64,80.01 IC3.8
  Bottom 0.406: v21.59,86.36 16.82,86.69 7.62,87 EDGE$.BE2
!BDAL3  (via drill 0.81)
  Top 0.406: v21.59,88.9 24.13,83.82 30.48,83.82 31.75,82.55 IC4.14 36.83,82.55 40.64,85.09 IC3.6
  Bottom 0.406: v21.59,88.9 16.79,89.89 7.62,90.17 EDGE$.BF2
!BDAL4  (via drill 0.81)
  Top 0.406: v21.59,91.44 24.13,88.9 29.21,88.9 31.75,87.63 IC4.16 36.83,87.63 40.64,90.17 IC3.4
  Bottom 0.406: v21.59,91.44 16.82,93.04 7.62,93.34 EDGE$.BH2
!BDAL5  (via drill 0.81)
  Top 0.406: v21.59,93.98 29.21,93.98 31.12,92.71 IC4.18
  Bottom 0.406: v21.59,93.98 16.84,96.19 7.62,96.52 EDGE$.BJ2 | IC4.18 36.83,92.71 40.64,95.25 IC3.2
!BDAL6
  Top 0.406: IC3.15 49.53,85.09 44.45,88.9 40.64,88.9 36.83,86.36 31.75,86.36 29.21,87.63 IC4.5
  Bottom 0.406: IC4.5 24.13,87.63 24.13,99.06 23.83,99.36 7.62,99.06 EDGE$.BK2
!BDAL7
  Top 0.406: IC3.17 46.36,90.17 45.09,91.44 29.85,91.44 29.21,92.71 IC4.3
  Bottom 0.406: IC4.3 29.21,92.71 29.21,100.33 27.94,101.6 17.78,101.6 15.57,102.54 7.62,102.87 EDGE$.BL2
!BDAL8  (via drill 0.81)
  Top 0.406: v22.86,105.41 29.21,105.41 31.75,104.14 IC1.11
  Bottom 0.406: EDGE$.BM2 22.53,105.74 v22.86,105.41
!BDAL9
  Bottom 0.406: EDGE$.BN2 26.34,108.89 IC1.8
!BDAL10
  Bottom 0.406: EDGE$.BP2 23.19,112.09 25.4,114.3 IC1.6
!BDAL11
  Bottom 0.406: EDGE$.BR2 21.26,115.24 25.4,119.38 IC1.4
!BDAL12
  Bottom 0.406: EDGE$.BS2 19.36,118.42 25.4,124.46 IC1.2
!BDIN
  Bottom 0.406: IC2.8 24.13,15.24 24.13,22.86 7.62,22.86 EDGE$.AH2
!BDOUT  (via drill 0.81)
  Top 0.406: IC2.13 32.39,13.97 29.85,12.7 22.86,12.7 v20.96,10.79
  Bottom 0.406: v20.96,10.79 15.24,16.51 7.62,16.51 EDGE$.AE2
!BHALT  (1 unrouted)
  Top 0.406: H1.1 19.05,42.55 7.62,41.91
!BIAKI  (1 unrouted)
!BINIT  (1 unrouted)
!BSYNC  (1 unrouted)
!DR_R0
  Top 0.406: IC18.6 124.46,43.18 121.92,41.91 99.06,41.91 97.79,43.18 93.98,43.18 92.71,44.45 IC20.18
!SYNC
  Top 0.406: IC2.3 29.21,26.67 29.21,36.2 33.02,36.2 34.29,34.92 52.71,34.92
+12V  (via drill 0.81)  (1 unrouted)
  Top 0.635: v21.59,97.79 24.13,101.6 v31.75,101.6 | IC24.14 176.53,100.33 176.53,108.58 174.63,109.86 | 174.63,109.86 176.53,111.76 176.53,114.94 178.44,116.84 187.33,116.84 R3.2 | 174.63,109.86 167.01,109.86 | 182.88,49.53 195.58,49.53 198.12,52.07 198.12,123.19 189.87,123.19 R4.2
  Bottom 0.635: EDGE$.BD2 22.86,83.82 22.86,96.52 v21.59,97.79 | v31.75,101.6 31.75,129.54 187.33,129.54 R3.2 R4.2
-12V
  Top 0.406: IC23.1 166.37,81.28 184.79,81.28 184.79,84.45 187.33,87 187.33,91.44 SV1.12
A3
  Bottom 0.406: IC5.15 A3.2 R32.2
A4
  Bottom 0.406: IC5.23 A4.2 R31.2
A5
  Bottom 0.406: R29.2 A5.2 IC5.17
A6
  Bottom 0.406: IC5.19 A6.2 R28.2
A7
  Bottom 0.406: IC5.21 A7.2 R27.2
A8
  Bottom 0.406: A8.2 R26.2 IC5.9
A9
  Bottom 0.406: IC5.7 R25.2 A9.2
A10
  Bottom 0.406: A10.2 R23.2 IC5.5
A11
  Bottom 0.406: A11.2 R21.2 IC5.3
A12  (1 unrouted)
  Bottom 0.406: A12.2 R19.2
B0  (1 unrouted)
  Top 0.406: IC22.12 154.94,72.39 152.4,74.93 140.34,74.93 138.43,73.66 133.35,73.66 132.08,71.12 126.37,71.12 122.56,66.67 104.78,66.67 104.14,66.04 90.17,66.04 82.55,78.74 56.52,78.74 52.71,76.2 47.63,76.2 45.72,77.47 IC3.9
B1
  Top 0.406: 88.27,83.82 76.84,83.82 74.3,81.92 70.49,81.92 69.22,83.19 57.79,83.19 52.71,81.28 47.63,81.28 46.36,82.55 IC3.7
B2
  Top 0.406: 89.54,81.28 75.57,81.28 74.3,80.64 69.85,80.64 68.58,81.92 58.42,81.92 52.71,77.47 IC3.12
B3  (via drill 0.81)  (1 unrouted)
  Top 0.406: IC5.14 77.47,101.6 74.93,100.33 v67.31,100.33
B4  (1 unrouted)
  Top 0.406: IC3.16 58.42,87.63 60.33,89.53 93.35,89.53
B5  (1 unrouted)
  Top 0.406: IC3.18 53.34,92.71 53.98,93.34 67.31,93.34 68.58,93.98 93.98,93.98 96.52,96.52 100.33,96.52
B6  (2 unrouted)
  Top 0.406: IC3.5 44.45,87.63 48.26,83.82 52.71,83.82 53.98,84.45 69.22,84.45 70.49,83.19 74.3,83.19 78.74,86.36 83.82,86.36 85.09,85.09 90.17,85.09 92.71,82.55 92.71,67.31 100.33,67.31 102.87,68.58 121.92,68.58
B7  (1 unrouted)
  Top 0.406: IC3.3 46.99,92.71 48.26,91.44 53.34,91.44 53.98,92.08 67.95,92.08 69.22,92.71 95.89,92.71 96.52,92.08
B8
  Top 0.406: IC1.9 29.21,106.68 31.75,105.41 49.53,105.41 54.61,100.33 64.77,100.33 68.58,104.14 IC5.10
B9
  Top 0.406: IC1.12 36.83,106.68 38.1,107.95 49.53,107.95 55.88,101.6 58.42,101.6 62.23,105.41 67.31,105.41 68.58,109.22 IC5.8
B10
  Top 0.406: IC1.14 50.17,111.76 52.71,114.3 55.88,114.3 58.42,111.76 59.69,111.76 60.96,113.03 67.31,113.03 68.58,114.3 IC5.6
B11
  Top 0.406: IC1.16 49.53,116.84 52.07,119.38 55.25,119.38 57.79,116.84 60.96,116.84 62.23,118.11 67.31,118.11 68.58,119.38 IC5.4
B12
  Top 0.406: IC1.18 49.53,121.92 51.44,123.83 55.88,123.83 57.79,121.92 60.33,121.92 61.6,123.19 67.31,123.19 68.58,124.46 IC5.2
BDCOK
  Top 0.406: IC1.13 31.75,109.22 29.21,107.95 20.96,107.95 20.96,100.33 17.78,97.79 17.78,83.82 19.05,81.28 19.05,73.66 7.62,73.66
  Top 0.635: EDGE$.BA1 7.62,73.66
BDMG
  Bottom 0.406: EDGE$.AS2 16.51,48.26 16.51,45.72 7.62,45.72 EDGE$.AR2
BS7
  Top 0.406: IC2.9 29.85,11.43 32.39,12.7 45.09,12.7 48.26,10.16 52.07,10.16 57.79,13.97 IC10.5
CLK0  (via drill 0.81)
  Top 0.406: IC20.17 87,46.99 v87.63,47.62 | v87.63,87.63 IC20.40
  Bottom 0.406: v87.63,47.62 v87.63,87.63
DA0
  Top 0.406: IC20.26 100.33,52.07 103.51,53.98
DOUT
  Top 0.406: IC10.12 64.77,19.05 63.5,17.78 55.88,17.78 52.07,15.24 32.39,15.24 30.48,16.51 IC2.7
DR0
  Top 0.406: IC20.19 90.17,41.91 91.44,42.55
EPS
  Top 0.635: IC20.39 98.43,85.09 100.97,88.27 EPS.2
FE0
  Top 0.406: IC20.14 78.11,54.61 73.66,52.07 71.12,52.07 69.85,50.8 58.42,50.8 55.25,53.34 39.37,53.34 38.74,53.98 33.02,53.98 33.02,43.81 Q1.2
GND  (via drill 0.81)  (34 unrouted)
  Top 0.635: EDGE$.BT1 14.91,121.59 16.6,121.58 | 16.6,121.58 21.34,127 IC1.1 28.7,127 31.07,124.46 IC1.19 40.64,124.46 v40.64,125.73 40.64,128.27 57.15,128.27 | 16.6,105.74 16.6,121.58 | EDGE$.BM1 16.6,105.74 | 16.6,105.74 v16.6,104.14 | v24.13,68.58 24.13,74.93 IC4.10 29.21,74.93 29.21,71.12 v31.12,70.48 33.66,69.22 V3.1 | 57.15,128.27 57.15,124.46 A12.1 | V6.1 V7.1 | 15.88,26.67 EDGE$.AJ1 | 15.88,26.67 15.88,36.2 7.62,36.2 EDGE$.AM1 | IC25.4 IC25.11 | IC9.7 41.91,6.99 59.69,6.99 | 59.69,6.99 72.39,6.99 74.93,8.89 IC11.7 | 59.69,6.99 IC10.7 | IC15.7 166.37,6.35 149.86,6.35 | 149.86,6.35 146.05,6.35 144.78,7.62 | 149.86,6.35 IC14.7 | 17.78,6.99 16.51,8.89 16.51,26.67 15.88,26.67 | NB1.1 125.73,83.19 128.91,81.28 130.18,81.28 | v114.3,125.73 114.3,128.27 57.15,128.27 | IC16.7 168.91,39.37 171.45,36.83 185.42,36.83 185.42,34.29 193.04,34.29 193.04,35.56 196.85,35.56 199.39,34.29 201.93,34.29 201.93,48.26 198.12,48.26
  Bottom 0.635: v16.6,104.14 IC1.10 | EDGE$.BC2 20.32,80.34 20.32,68.58 v24.13,68.58 | IC3.10 45.72,74.93 V3.1 | 62.23,62.23 V4.1 | A12.1 A11.1 A10.1 A9.1 A8.1 58.42,101.6 | A3.1 A5.1 A6.1 A7.1 A4.1 | 58.42,101.6 IC5.11 IC5.12 71.12,97.79 | 71.12,97.79 71.12,95.25 77.47,90.17 77.47,82.55 IC20.3 | EPS.1 NB1.1 NB2.1 TSB.1 NP.1 | IC7.8 38.74,36.83 Q1.1 | IC3.19 58.42,95.25 58.42,101.6 | IC3.1 40.64,97.79 v40.64,125.73 | 62.23,62.23 IC6.8 | 62.23,86.36 62.23,62.23 | 62.23,86.36 V5.1 | 62.23,86.36 62.23,97.79 71.12,97.79
IAKI
  Top 0.406: IC2.18 36.83,26.67 38.74,25.4 | 38.74,25.4 40.64,24.13 IC9.1 | 177.17,34.92 175.9,35.56 146.69,35.56 142.88,33.66 113.67,33.66 111.13,32.38 88.27,32.38 86.36,31.11 78.74,31.11 77.47,29.84 54.61,29.84 53.34,28.57 45.72,28.57 44.45,29.84 40.01,29.84 38.74,28.57 38.74,25.4
INIT
  Top 0.406: 27.94,21.59 IC2.5 23.5,24.77 23.5,33.02 24.77,34.92 24.77,43.81 20.32,47.62 20.32,82.55 19.05,84.45 19.05,95.89 24.13,95.89 24.13,99.06 32.39,99.06 34.29,100.97 51.44,100.97 54.61,98.42 67.95,98.42 69.85,96.52 89.54,96.52 92.08,100.33 104.78,100.33 106.68,102.23 114.94,102.23 116.21,99.06 120.65,99.06 121.29,99.69
  Bottom 0.406: IC2.6 IC2.5
N$1
  Top 0.406: IC5.13 76.2,99.06 75.57,98.42
N$2
  Top 0.406: IC1.7 29.21,111.76 30.48,110.49 36.83,110.49 38.1,109.22 55.25,109.22 57.79,106.68 59.06,106.68 62.23,110.49 74.93,110.49 77.47,105.41 89.54,105.41 89.54,101.6 104.14,101.6 106.05,103.5 138.43,103.5 140.97,105.41 140.97,114.94 IC27.5
N$3
  Bottom 0.406: H1.2 Q1.3
N$4  (1 unrouted)
  Top 0.406: IC6.15 64.77,77.47 62.87,76.2 55.88,76.2 54.61,74.93
N$5  (1 unrouted)
  Top 0.406: 57.15,56.52 41.91,56.52 IC7.1
N$7
  Top 0.406: IC4.1 29.21,97.79 31.75,95.25 IC4.19 37.47,95.25 39.37,96.52 66.68,96.52 67.95,95.25 90.17,95.25 93.98,99.06 106.05,99.06 107.32,98.42 113.67,98.42 114.3,96.52 121.92,96.52 123.19,95.25 IC26.3 132.08,95.25 134.62,93.98 139.07,93.98 141.61,92.08
N$8
  Bottom 0.406: IC6.14 R18.2 72.39,82.55 67.95,82.55 V5.2
N$9  (2 unrouted)
  Top 0.406: IC11.2 86.36,21.59 87.63,22.86 96.52,22.86 | 104.78,46.35 105.41,46.99 114.3,46.99 116.84,49.53 125.73,49.53 127,54.61 132.08,54.61 133.35,53.34 IC18.13 143.51,53.34 146.05,45.72 150.5,45.72 154.31,41.91 IC17.9
N$10  (1 unrouted)
  Top 0.406: IC8.4 55.25,44.45 54.61,43.81
N$11
  Top 0.406: IC8.7 IC7.9 47.63,36.83 45.09,38.1 40.01,38.1 38.74,36.83 35.94,36.83 34.71,38.1 34.71,39.37 31.12,42.55 31.12,46.99
N$12  (1 unrouted)
  Top 0.406: 79.38,107.95 91.44,107.95 91.44,102.87 102.87,102.87 105.41,105.41 105.41,123.19 134.62,123.19 134.62,118.75 142.88,118.75 142.88,109.86 155.58,109.86 155.58,107.31 163.83,107.31 163.83,92.08 163.2,90.81 163.2,85.09 IC25.8
N$13  (via drill 0.81)
  Top 0.406: IC4.2 29.21,95.25 31.12,93.98 52.71,93.98 53.98,95.25 v65.41,95.25
N$14
  Top 0.406: IC7.7 45.09,39.37 46.99,38.1 62.87,38.1 65.41,34.29 IC8.9
N$15
  Top 0.406: IC8.12 64.77,41.91 62.23,43.18 56.52,43.18 55.25,41.91 53.34,41.91 52.07,43.18 47.63,43.18 45.09,46.99 IC7.4
N$16  (via drill 0.81)
  Top 0.406: v19.05,120.65 19.05,100.33 16.51,98.42 16.51,78.74 17.15,78.11
N$17
  Top 0.406: R15.2 IC7.2
  Bottom 0.406: R15.2 V7.2
N$18
  Top 0.406: IC7.5 39.37,44.45 38.1,46.99 V6.2
  Bottom 0.406: V6.2 R14.2
N$19
  Bottom 0.406: IC9.9 IC9.10
N$20
  Top 0.406: R34.2 20.32,17.78 20.32,26.67 22.23,30.48 R35.2
N$21
  Bottom 0.406: V4.2 71.12,56.52 R17.2 71.12,67.31 IC6.11
N$22
  Top 0.635: IC10.2 IC10.13
N$23
  Top 0.406: IC14.6 145.42,11.43 142.24,8.89 142.24,5.71 107.95,5.71 107.95,11.43 IC11.9 90.17,11.43 87.63,10.16 65.41,10.16 62.23,15.24 57.15,15.24 52.07,12.7 47.63,12.7 46.36,13.97 IC9.5
  Bottom 0.406: IC11.9 IC11.10
N$24
  Top 0.406: IC6.5 57.15,69.85 55.25,69.22 V3.2
  Bottom 0.406: R16.2 V3.2
N$25
  Top 0.406: IC15.4 161.29,16.51 160.02,17.78 153.67,17.78 151.13,20.32 141.61,20.32 140.34,21.59 IC13.13 134.62,21.59 133.35,24.13 IC13.1
N$28
  Top 0.406: IC4.8 21.59,80.01 21.59,65.41 40.01,65.41 40.64,64.77 46.99,64.77 51.44,71.75 55.88,71.75 56.52,72.39 IC6.4
N$32
  Top 0.406: IC13.2 131.45,21.59 132.72,19.05 IC13.12
N$33
  Top 0.635: IC16.5 163.83,44.45 162.56,45.72 160.02,45.72 158.75,49.53 IC17.12
N$34
  Top 0.406: IC17.3 151.13,49.53 153.67,46.99 IC17.11
N$35
  Top 0.406: IC17.4 151.13,46.99 153.67,44.45 IC17.10 160.02,44.45 162.56,43.18
N$36
  Top 0.406: IC18.5 IC18.10 139.7,45.72 139.7,41.91 125.73,41.91 124.46,40.64 IC19.9
N$37
  Top 0.406: IC19.13 IC19.4 109.22,50.8 105.41,48.26 92.71,48.26 90.17,45.72 55.88,45.72 54.61,46.99
N$38  (via drill 0.81)
  Top 0.406: v163.2,121.28 161.29,127 142.24,127 142.24,122.56 IC27.2
N$39
  Top 0.406: IC26.1 132.08,100.33 134.62,95.25 IC26.12
N$40  (1 unrouted)
N$41
  Top 0.406: IC25.12 158.75,95.25 158.75,92.71 161.29,90.17 161.29,86.36 144.78,86.36 144.15,87 142.88,87
N$42
  Top 0.406: IC25.13 153.67,97.79 151.13,96.52 143.51,96.52 142.24,95.89
N$43  (via drill 0.81)
  Top 0.406: v161.29,104.78 v145.42,104.78
N$44
  Top 0.406: IC24.1 168.91,100.33 168.91,92.71 170.18,91.44 170.18,90.17 171.45,88.9 177.8,88.9 177.8,90.81
N$45
  Top 0.406: 177.8,87 176.53,86.36 171.45,86.36 169.55,88.27 169.55,89.53 168.91,90.17 IC24.5 164.47,90.17 164.47,83.82 160.02,83.82 159.39,83.19 146.69,83.19 145.42,85.09 IC26.8
N$46
  Top 0.406: SV1.11 186.69,93.98 185.42,92.71 185.42,87 181.61,83.19 169.55,83.19 169.55,86.36 168.91,87.63 IC24.6
N$47
  Top 0.406: SV1.8 190.5,101.6 186.06,97.16 184.15,97.16 181.61,94.61 177.8,94.61 176.53,92.71 IC24.11
N$48  (1 unrouted)
  Top 0.406: 172.72,85.09 180.34,85.09 182.88,87.63 182.88,92.71 184.79,95.25 191.14,95.25 192.41,96.52 SV1.10
N$49
  Top 0.406: IC23.13 177.8,74.93 177.8,78.74 189.87,78.74 191.77,81.28 SV1.16
N$50
  Top 0.406: IC23.3 168.91,72.39 168.91,80.01 189.23,80.01 190.5,81.92 190.5,88.9 SV1.13
N$51
  Top 0.406: IC23.10 176.53,67.31 177.8,69.85 190.5,69.85 190.5,77.47 191.77,78.74 SV1.17
N$52
  Top 0.406: SV2.3 191.77,63.5 189.23,59.69 147.32,59.69 144.78,58.42 140.97,58.42
N$53
  Top 0.406: 194.31,53.34 191.77,54.61 176.53,54.61 176.53,55.88 166.37,55.88 IC16.1
N$54
  Top 0.406: IC16.12 171.45,49.53 169.55,50.8 164.47,50.8 160.02,57.78 146.69,57.78 145.42,56.52 140.97,56.52 139.07,58.42 130.18,58.42
N$55
  Top 0.406: IC18.1 133.35,55.88 134.62,54.61 146.05,54.61 147.32,55.88 158.75,55.88 165.1,48.26 168.28,48.26 171.45,44.45 IC16.10
N$56
  Top 0.406: IC16.11 176.53,46.99 176.53,43.18 165.1,43.18 161.93,40.64 143.51,40.64 140.97,49.53 132.72,49.53 131.45,50.8 IC18.3
N$57
  Top 0.406: IC18.11 133.35,48.26 132.08,46.99 124.46,46.99 123.83,46.35
N$58
  Top 0.406: IC19.11 121.29,45.72 121.92,48.26 IC18.4
N$59
  Top 0.406: IC19.2 109.22,55.88 106.68,57.78 99.7,57.78 97.79,55.88 92.71,55.88 91.44,53.98 86.36,53.98 83.82,58.42 76.84,58.42 73.03,56.52 67.95,56.52 66.04,55.24
N$60
  Top 0.406: IC19.7 101.6,43.18 98.43,45.09 98.43,46.35
N$61
  Top 0.406: IC19.6 107.95,45.72 106.68,44.45 101.6,44.45 100.97,46.35
N$62
  Top 0.406: IC16.4 163.83,46.99 161.29,50.8 153.67,50.8 152.4,52.07 IC17.2
N$63
  Top 0.406: IC16.9 171.45,41.91 170.18,40.64 165.1,40.64 163.83,39.37 IC17.8
N$64
  Top 0.406: IC28.2 180.34,38.1 180.34,48.26
N$65
  Top 0.406: 179.07,35.56 179.07,33.02 185.42,25.4 IC29.2
N$67  (via drill 0.81)
  Top 0.406: v166.37,104.14 170.18,104.14 171.45,101.6 171.45,91.44 172.72,90.17 IC24.10
N$68
  Top 0.406: IC23.8 172.09,62.23 170.18,66.04 146.05,66.04 144.78,61.59 140.97,61.59 139.7,63.5 134.62,63.5 132.08,64.77 IC21.6
N$69
  Top 0.406: IC26.10 139.7,90.17 142.24,88.9 160.02,88.9
N$70
  Top 0.406: IC23.11 172.72,69.85 170.18,68.58 163.83,68.58 161.29,71.12 154.31,71.12 151.77,73.66 141.61,73.66 139.07,71.12 135.26,71.12 133.35,67.31 IC21.5
N$71
  Top 0.406: IC22.13 160.02,74.93 160.66,72.39 162.56,72.39
N$72
  Top 0.406: IC15.13 177.8,21.59 177.8,4.45 78.74,4.45 78.11,5.08
N$74
  Top 0.406: IC16.3 168.91,49.53 170.82,48.26 177.17,48.26 179.71,50.8 193.04,50.8 195.58,52.07 195.58,68.58 SV2.1
N$76
  Top 0.406: IC18.2 132.08,53.34 133.35,52.07 142.24,52.07 144.78,41.91 IC17.6
N$77
  Top 0.406: IC26.2 127,97.79 126.37,97.16 123.83,97.16
N$78
  Top 0.406: 164.47,33.66 146.05,33.66 143.51,32.38 115.57,32.38 112.4,31.11 88.9,31.11 87,29.84 79.38,29.84 78.11,28.57 56.52,28.57 55.25,27.94
N$79  (1 unrouted)
  Top 0.406: 156.85,31.75 154.31,32.38 147.32,32.38 145.42,31.11 133.99,31.11 132.08,28.57 89.54,28.57 87.63,27.3 80.65,27.3 79.38,26.04 62.87,26.04 61.6,24.13 54.61,24.13 52.71,26.04 41.91,26.04 40.64,27.3
N$80
  Top 0.406: 177.17,31.11 167.01,31.11 164.47,27.94 139.7,27.94 138.43,27.3
N$82
  Top 0.406: IC14.1 152.4,24.13 153.67,22.86 170.82,22.86 172.72,20.32 176.53,20.32 176.53,16.51 IC15.11
N$83
  Top 0.406: IC15.2 170.18,21.59 172.09,19.05 IC15.12
N$84
  Top 0.406: IC15.9 171.45,11.43 171.45,17.14 168.91,20.32 163.83,20.32 163.83,21.59 IC14.13
N$85
  Top 0.406: IC14.10 IC15.5
N$86
  Top 0.406: IC14.11 158.75,16.51 161.29,15.24 168.91,15.24 | 168.91,15.24 168.91,10.16 153.67,10.16 151.13,12.7 144.78,12.7 140.97,9.53 140.97,6.99 109.22,6.99 109.22,12.06 107.95,14.61 97.16,14.61 93.98,16.51 IC11.11 | IC15.3 167.64,19.05 168.91,17.78 168.91,15.24
N$87
  Top 0.406: 43.18,27.94 45.09,27.3 52.71,27.3 54.61,26.04 56.52,26.04 58.42,27.3 78.11,27.3 80.01,28.57 87.63,28.57 89.54,29.84 127,29.84 129.54,30.48
N$88
  Top 0.406: 148.59,31.11 146.05,29.21 135.26,29.21 133.99,27.3 107.32,27.3 104.78,24.77 100.97,24.77 99.06,26.04 90.81,26.04 88.27,24.13 IC11.1
N$89
  Top 0.406: 142.24,22.86 143.51,21.59 IC14.2
N$90
  Top 0.406: IC14.12 160.02,19.05 160.66,19.68 162.56,19.68
N$91
  Top 0.406: IC14.9 154.94,11.43 151.13,15.24 135.26,15.24 133.99,13.97 IC13.5
N$92
  Top 0.406: IC14.3 143.51,19.05 142.24,17.78 127,17.78 124.46,15.24 116.84,15.24 114.3,17.78 97.79,17.78 93.98,20.32 88.9,20.32 86.36,17.78 71.12,17.78 69.22,20.32 64.77,20.32 62.23,19.05 IC10.3
N$93
  Top 0.406: IC14.5 144.15,13.97 139.7,10.16 127,10.16 125.73,11.43 IC12.9
N$94
  Top 0.406: IC13.11 133.35,16.51 132.08,15.24 127,15.24 124.46,12.7 116.84,12.7 115.57,11.43 IC12.6
N$95
  Top 0.406: 73.66,22.86 75.57,20.32 87,20.32 88.9,21.59 IC11.13 94.62,21.59 95.89,20.95 98.43,20.95 99.06,21.59 107.32,21.59 109.22,22.86 114.3,22.86 116.84,17.78 125.1,17.78 125.73,18.41
N$96
  Top 0.406: 102.24,26.67 101.6,27.3 90.81,27.3 88.9,26.04 81.28,26.04 79.38,24.13 76.2,24.13
N$97
  Top 0.406: IC12.3 114.3,19.05 116.84,16.51 IC12.11
N$98
  Top 0.406: IC12.12 123.83,19.05 123.83,24.77
N$99
  Top 0.406: IC26.6 132.08,87.63 133.35,86.36 133.35,83.19 143.51,83.19 146.69,79.38 151.77,79.38 153.04,80.64
N$100
  Top 0.406: IC12.5 109.22,13.97 109.22,15.88 98.43,15.88 94.62,17.78 88.9,17.78 86.36,15.24 81.28,15.24 80.01,16.51 IC10.11
N$101
  Top 0.406: 106.05,8.89 106.05,6.99 76.2,6.99 74.3,5.71 39.37,5.71 39.37,7.62
N$102
  Top 0.406: 88.9,12.7 80.65,12.7 78.74,15.24 64.77,15.24 63.5,16.51 IC10.4
N$103
  Top 0.406: IC11.6 70.49,11.43 70.49,13.97 IC10.10
N$104
  Top 0.406: IC11.3 72.39,19.05 69.85,22.86 46.99,22.86 44.45,21.59 IC9.2
N$105
  Top 0.406: IC9.3 39.37,19.05 38.1,20.32 31.75,20.32 31.75,34.29
N$106
  Top 0.406: IC9.8 47.63,8.89 45.09,10.16 38.74,10.16 37.47,8.89 37.47,6.35 21.59,6.35 17.78,10.16 17.78,28.57
N$107
  Top 0.406: IC9.11 48.26,16.51 45.72,17.78 29.85,17.78 29.85,25.4 25.4,25.4 24.77,26.04 24.77,32.38 26.04,34.29 26.04,45.72 22.86,48.9 22.86,61.59
N$108
  Top 0.406: IC9.6 38.1,11.43 36.83,10.16 24.13,10.16
N$109
  Top 0.406: IC7.11 51.44,41.91 52.71,40.64 55.88,40.64 57.15,41.91 IC8.5
N$111
  Top 0.406: IC7.14 46.36,49.53 45.72,48.9
N$112
  Top 0.406: 53.34,31.11 76.84,31.11 78.11,32.38 85.73,32.38 87.63,33.66 110.49,33.66 112.4,34.92 139.7,34.92 140.34,35.56
N$113
  Top 0.406: 133.35,36.83 132.08,36.2 111.76,36.2 109.22,34.92 88.9,34.92 87,36.2 84.46,36.2 81.92,34.92 76.84,34.92 75.57,33.66 70.49,33.66 69.85,36.83 IC8.10
N$114
  Top 0.406: 57.15,32.38 76.2,32.38 77.47,33.66 83.82,33.66 84.46,34.29
N$115
  Top 0.406: IC8.6 63.5,39.37 64.77,38.1 71.12,38.1 71.76,37.47 81.28,37.47 83.19,38.73 91.44,38.73
N$116
  Top 0.406: 73.03,35.56 74.3,36.2 81.28,36.2 83.82,37.47 88.27,37.47 89.54,36.83 96.52,36.83 98.43,38.73 100.97,38.73 101.6,38.1 105.41,38.1 107.95,40.64 IC19.8
N$117
  Top 0.406: IC18.8 134.62,40.64 131.45,37.47 110.49,37.47 109.22,36.83 99.06,36.83
N$118
  Top 0.406: IC18.9 134.62,43.18 132.08,44.45 123.19,44.45 121.92,43.18 IC19.10
N$119
  Top 0.406: 108.59,95.25 110.49,93.98 119.38,93.98 120.65,92.71 125.73,92.71 127,90.17 IC26.5
N$120
  Top 0.406: IC26.13 135.26,97.79 133.35,101.6 127,101.6 127,99.06 123.19,99.06 121.92,97.79 115.57,97.79 114.3,100.33 111.13,100.33
N$121
  Top 0.406: IC8.14 76.2,46.99 77.47,48.26
N$122
  Top 0.406: IC8.2 63.5,49.53 64.77,48.26 71.12,48.26 72.39,48.9
N$123
  Top 0.406: IC6.7 57.79,64.77 55.88,62.23 40.01,62.23 39.37,61.59 36.83,61.59 34.93,63.5 24.77,63.5
N$124
  Top 0.406: IC6.9 64.77,62.23 62.87,63.5 58.42,63.5 56.52,60.33 36.2,60.33 35.56,60.96 29.21,60.96 28.58,59.69
N$125
  Top 0.406: IC26.9 134.62,87.63 133.35,88.9 125.73,88.9 124.46,91.44 119.38,91.44 118.11,92.71 107.32,92.71 106.05,95.25
N$126
  Top 0.406: IC8.15 69.85,49.53 71.12,50.8 101.6,50.8 103.51,52.07 123.19,52.07
N$127  (via drill 0.81)
  Top 0.406: IC26.11 134.62,92.71 132.08,93.98 121.92,93.98 120.65,95.25 113.67,95.25 112.4,97.16 102.24,97.16 99.06,90.17 95.89,90.17 94.62,91.44 90.81,91.44 90.17,90.81 57.15,90.81 v55.88,90.17
N$128
  Top 0.406: IC22.9 152.4,64.77 151.13,63.5 146.69,63.5 146.05,60.33 127.64,60.33 127,59.05 125.1,59.05 123.83,57.15 117.48,57.15 114.94,60.33 109.22,60.33 107.95,59.69 99.7,59.69 97.79,58.42 91.44,58.42 88.9,55.88
N$129
  Top 0.406: IC22.11 153.67,69.85 152.4,68.58 144.15,68.58 144.15,65.41 142.88,63.5
N$130
  Top 0.406: IC21.9 140.97,64.77 142.88,67.31
N$131
  Top 0.406: IC22.3 146.69,72.39 146.69,69.85 142.24,69.85 139.07,66.04 127.64,66.04 125.1,61.59 122.56,61.59
N$132
  Top 0.406: IC21.8 132.72,62.23 132.08,63.5 127.64,63.5 125.73,60.33 123.83,60.33 122.56,59.05
N$133
  Top 0.406: IC21.12 134.62,72.39 132.72,68.58 127.64,68.58 124.46,63.5 120.02,63.5 120.02,61.59 109.22,61.59 107.95,60.96 76.84,60.96 76.2,60.33
N$134
  Top 0.406: IC22.1 144.15,77.47 142.88,76.2 133.35,76.2 132.08,77.47 IC21.1
N$135
  Top 0.406: 127.64,80.01 128.27,79.38 142.88,79.38
N$136
  Top 0.406: IC21.11 139.7,69.85 141.61,71.75 144.78,71.75
N$137
  Top 0.406: IC21.4 127,69.85 123.19,65.41 107.32,65.41 106.05,63.5 74.93,63.5 74.3,64.14
N$141
  Top 0.406: 123.83,54.61 107.32,54.61 106.05,55.88 100.97,55.88 98.43,53.34 92.71,53.34 91.44,52.07 85.09,52.07 83.19,55.88 78.11,55.88 73.66,53.34 64.77,53.34 63.5,52.07 IC8.1
N$156
  Top 0.406: 34.93,59.05 35.56,58.42 52.07,58.42
NB1
  Top 0.635: IC20.38 99.06,82.55 101.6,83.19 NB1.2
NB2
  Top 0.635: IC20.37 99.06,80.01 101.6,78.74 114.94,78.74 NB2.2
NP
  Top 0.635: IC20.35 97.79,74.93 100.97,73.03 111.76,73.03 NP.2
RB0  (1 unrouted)
  Top 0.406: IC7.10 55.88,39.37 57.15,40.64 74.93,40.64 75.57,41.27
RB1  (1 unrouted)
  Top 0.406: IC20.11 71.76,62.23 70.49,60.33 59.06,60.33 57.15,58.42 54.61,58.42 | IC7.13 52.07,46.99 54.61,50.8
RB2  (1 unrouted)
  Top 0.406: IC6.3 62.87,74.93 64.77,76.2 70.49,76.2 71.12,76.83 73.66,76.83 74.3,75.56 76.2,75.56
RB3
  Top 0.406: IC6.6 62.87,67.31 64.77,66.04 69.85,66.04 73.03,68.58 76.2,68.58 78.11,67.31 IC20.9
RB4
  Top 0.406: IC20.8 82.55,69.85 82.55,66.04 72.39,66.04 69.85,64.77 IC6.10
RB5
  Top 0.406: IC6.13 69.85,72.39 70.49,71.75 76.84,71.75 78.11,72.39 IC20.7
RB6  (1 unrouted)
  Top 0.406: IC20.6 82.55,74.93 82.55,71.12 78.74,71.12 76.2,69.85 72.39,69.85 71.12,68.58 58.42,68.58 54.61,63.5 38.1,63.5
RB7  (1 unrouted)
  Top 0.406: IC20.5 78.11,77.47 78.11,74.3 76.2,73.03 70.49,73.03 69.85,73.66 55.88,73.66 55.25,73.03 49.53,73.03 46.99,71.75 41.91,71.75 41.91,71.12
SYNC
  Bottom 0.406: IC2.16 IC2.17
TSB
  Top 0.635: IC20.36 107.95,77.47 109.86,75.56 TSB.2
VCC  (via drill 0.81)  (20 unrouted)
  Top 0.406: IC20.34 97.79,72.39 99.7,70.48 111.13,70.48
  Top 0.635: EDGE$.BV1 19.97,127.88 21.38,129.12 29.51,129.12 31.45,127 IC1.20 | v66.04,58.42 R17.1 60.96,57.15 58.42,54.61 IC7.16 | IC4.20 38.1,97.79 40.64,99.69 50.8,99.69 IC3.20 | R18.1 73.66,85.09 77.47,87.63 IC20.1 85.09,87.63 | IC2.20 36.83,31.75 38.74,31.11 46.99,31.11 47.63,30.48 | IC11.14 95.25,24.13 95.89,24.77 98.43,24.77 99.7,23.5 106.05,23.5 109.22,26.04 119.38,26.04 | 119.38,26.04 137.16,26.04 IC13.14 146.05,24.13 147.96,26.04 157.48,26.04 | 119.38,26.04 IC12.14 | 157.48,26.04 173.99,26.04 IC15.14 183.52,24.13 183.52,22.23 | 157.48,26.04 IC14.14 | IC25.1 IC26.14 | IC16.2 168.91,52.07 171.45,54.61 IC16.14
  Bottom 0.635: v66.04,58.42 66.04,80.01 IC6.16 | 48.26,97.79 IC3.20 | 48.26,97.79 48.26,66.67 R16.1 | R19.1 R21.1 R23.1 R25.1 R26.1 55.88,104.14 48.26,104.14 48.26,97.79 | R32.1 R29.1 R28.1 R27.1 R31.1 102.87,128.27 86.36,128.27 IC5.24 | R18.1 69.85,88.9 64.77,88.9 64.77,52.07 | 64.77,52.07 64.77,24.13 IC10.14 | 64.77,52.07 IC8.16 | IC1.20 36.83,127 36.83,97.79 IC4.20 | IC25.14 IC25.1
XDATA0
  Top 0.406: IC20.25 103.51,49.53 104.78,50.16
XRDY0
  Top 0.406: 104.78,40.01 99.06,40.01 97.16,41.91 IC20.22 93.35,40.64 77.47,40.64 77.47,44.45 IC8.13